# EAGLE design KIM_6530_replacement (EAGLE 6.6.0)
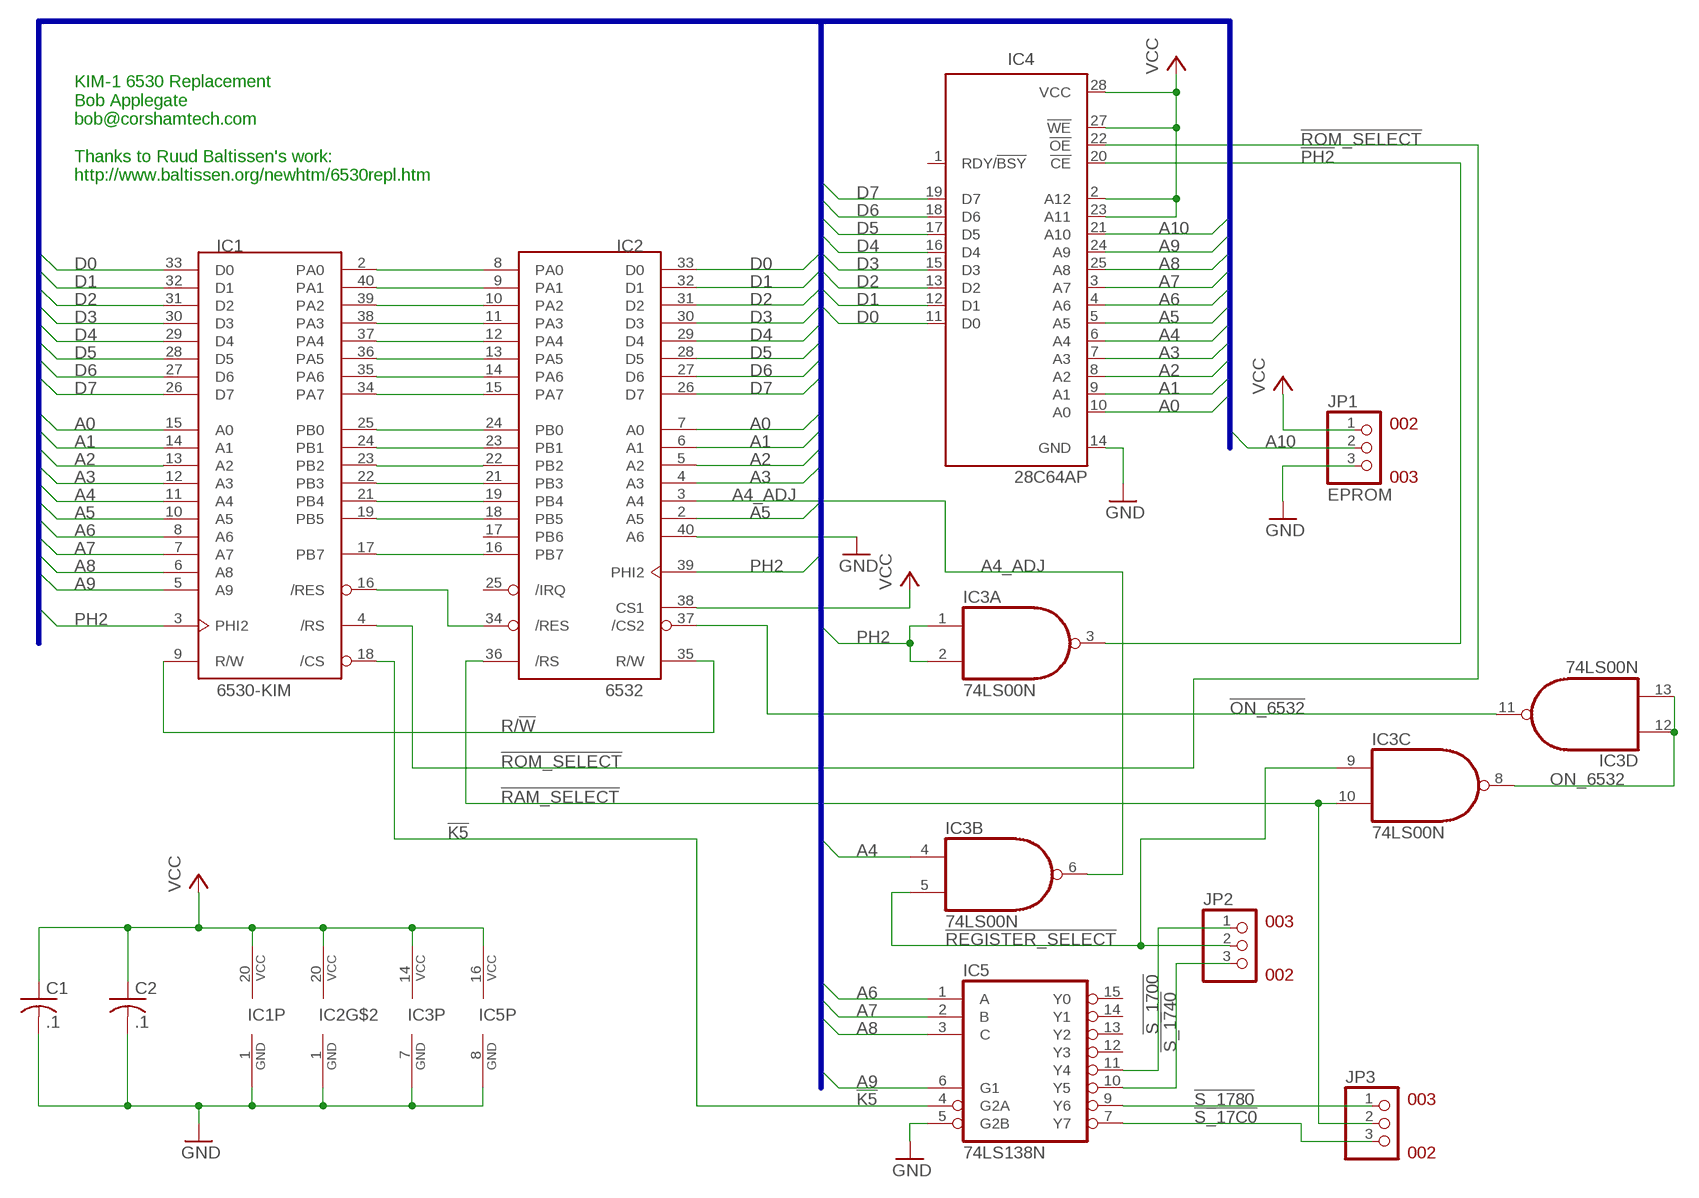
[diagram p0: schematic, sheet 1]

## Parts
C1  .1  C-US025-025X050  [C025-025X050]
C2  .1  C-US025-025X050  [C025-025X050]
IC1  6530-KIM  [DIP40]
IC2  6532  [DIP40]
IC3  74LS00N  [DIL14]
IC4  28C64AP  [DIL28-6]
IC5  74LS138N  [DIL16]
JP1  EPROM  PINHD-1X3  [1X03]
JP2  PINHD-1X3  [1X03]
JP3  PINHD-1X3  [1X03]

## Nets
!K5: IC1.18(/CS) IC5.4(G2A)
!ON_6532: IC2.37(/CS2) IC3.11(D:O)
!PH2: IC3.3(A:O) IC4.20(!CE)
!RAM_SELECT: IC2.36(/RS) IC3.10(C:I1) JP3.2
!REGISTER_SELECT: IC3.5(B:I1) IC3.9(C:I0) JP2.2
!ROM_SELECT: IC1.4(/RS) IC4.22(!OE)
!S_17C0: IC5.7(Y7) JP3.3
!S_1700: IC5.11(Y4) JP2.1
!S_1740: IC5.10(Y5) JP2.3
!S_1780: IC5.9(Y6) JP3.1
A0: IC1.15(A0) IC2.7(A0) IC4.10(A0)
A1: IC1.14(A1) IC2.6(A1) IC4.9(A1)
A2: IC1.13(A2) IC2.5(A2) IC4.8(A2)
A3: IC1.12(A3) IC2.4(A3) IC4.7(A3)
A4: IC1.11(A4) IC3.4(B:I0) IC4.6(A4)
A4_ADJ: IC2.3(A4) IC3.6(B:O)
A5: IC1.10(A5) IC2.2(A5) IC4.5(A5)
A6: IC1.8(A6) IC4.4(A6) IC5.1(A)
A7: IC1.7(A7) IC4.3(A7) IC5.2(B)
A8: IC1.6(A8) IC4.25(A8) IC5.3(C)
A9: IC1.5(A9) IC4.24(A9) IC5.6(G1)
A10: IC4.21(A10) JP1.2
D0: IC1.33(D0) IC2.33(D0) IC4.11(D0)
D1: IC1.32(D1) IC2.32(D1) IC4.12(D1)
D2: IC1.31(D2) IC2.31(D2) IC4.13(D2)
D3: IC1.30(D3) IC2.30(D3) IC4.15(D3)
D4: IC1.29(D4) IC2.29(D4) IC4.16(D4)
D5: IC1.28(D5) IC2.28(D5) IC4.17(D5)
D6: IC1.27(D6) IC2.27(D6) IC4.18(D6)
D7: IC1.26(D7) IC2.26(D7) IC4.19(D7)
GND: C1.2 C2.2 IC1.1(GND) IC2.1(GND) IC2.40(A6) IC3.7(P:GND) IC4.14(GND) IC5.5(G2B) IC5.8(GND) JP1.3
N$1: IC1.2(PA0) IC2.8(PA0)
N$2: IC1.40(PA1) IC2.9(PA1)
N$3: IC1.39(PA2) IC2.10(PA2)
N$4: IC1.38(PA3) IC2.11(PA3)
N$5: IC1.37(PA4) IC2.12(PA4)
N$6: IC1.36(PA5) IC2.13(PA5)
N$7: IC1.35(PA6) IC2.14(PA6)
N$8: IC1.34(PA7) IC2.15(PA7)
N$9: IC1.25(PB0) IC2.24(PB0)
N$10: IC1.24(PB1) IC2.23(PB1)
N$11: IC1.23(PB2) IC2.22(PB2)
N$12: IC1.22(PB3) IC2.21(PB3)
N$13: IC1.21(PB4) IC2.19(PB4)
N$14: IC1.19(PB5) IC2.18(PB5)
N$15: IC1.17(PB7) IC2.16(PB7)
N$16: IC1.16(/RES) IC2.34(/RES)
ON_6532: IC3.8(C:O) IC3.12(D:I0) IC3.13(D:I1)
PH2: IC1.3(PHI2) IC2.39(PHI2) IC3.1(A:I0) IC3.2(A:I1)
R/!W: IC1.9(R/W) IC2.35(R/W)
VCC: C1.1 C2.1 IC1.20(VCC) IC2.20(VCC) IC2.38(CS1) IC3.14(P:VCC) IC4.2(A12) IC4.23(A11) IC4.27(!WE) IC4.28(VCC) IC5.16(VCC) JP1.1
Unconnected: IC2.17(PB6) IC2.25(/IRQ) IC4.1(RDY/!BSY) IC5.12(Y3) IC5.13(Y2) IC5.14(Y1) IC5.15(Y0)

## Buses
A[0..15],D[0..7],PH2

## Notes on the sheet
- KIM-1 6530 Replacement
  Bob Applegate
  bob@corshamtech.com
  
  Thanks to Ruud Baltissen's work:
  http://www.baltissen.org/newhtm/6530repl.htm
- 002
- 003
- 003
- 002
- 003
- 002

## Library data of the parts
C1 C2 = rcl:C-US: CAPACITOR, American symbol
IC1 = 0RB_65xx:6530-KIM: I/O device with onboard ROM and RAM. Several configurations possible. This is the KIM version.
IC2 = 0RB_65xx:6532: I/O device with onboard 128 bytes of RAM.
IC3 = 74xx-us:74*00: Quad 2-input NAND gate
IC4 = microchip:28*64A: CMOS EEPROM 64 K (8 K x 8), low voltage; MPN: AT28C64B-15PU; OC_FARNELL: 1631144; OC_NEWARK: 96K6557
IC5 = 74xx-us:74*138: 3-line to 8-line DECODER/DEMULTIPLEXER
JP1-JP3 = pinhead:PINHD-1X3: PIN HEADER

## Board
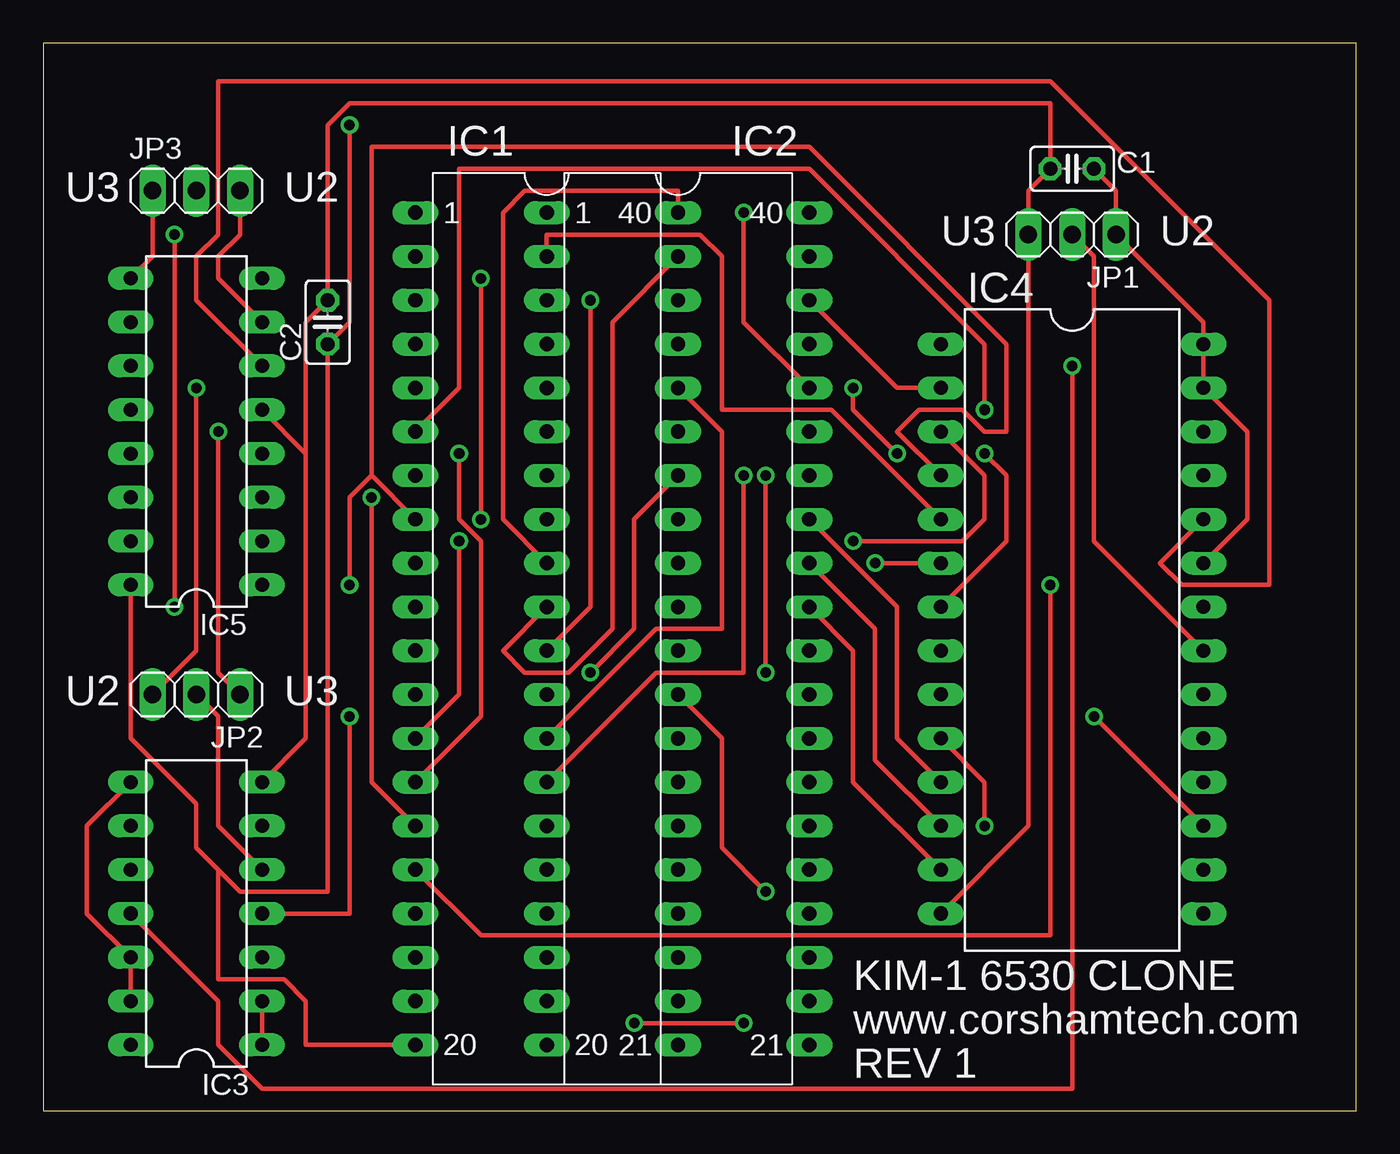
[diagram p1: board, top side]
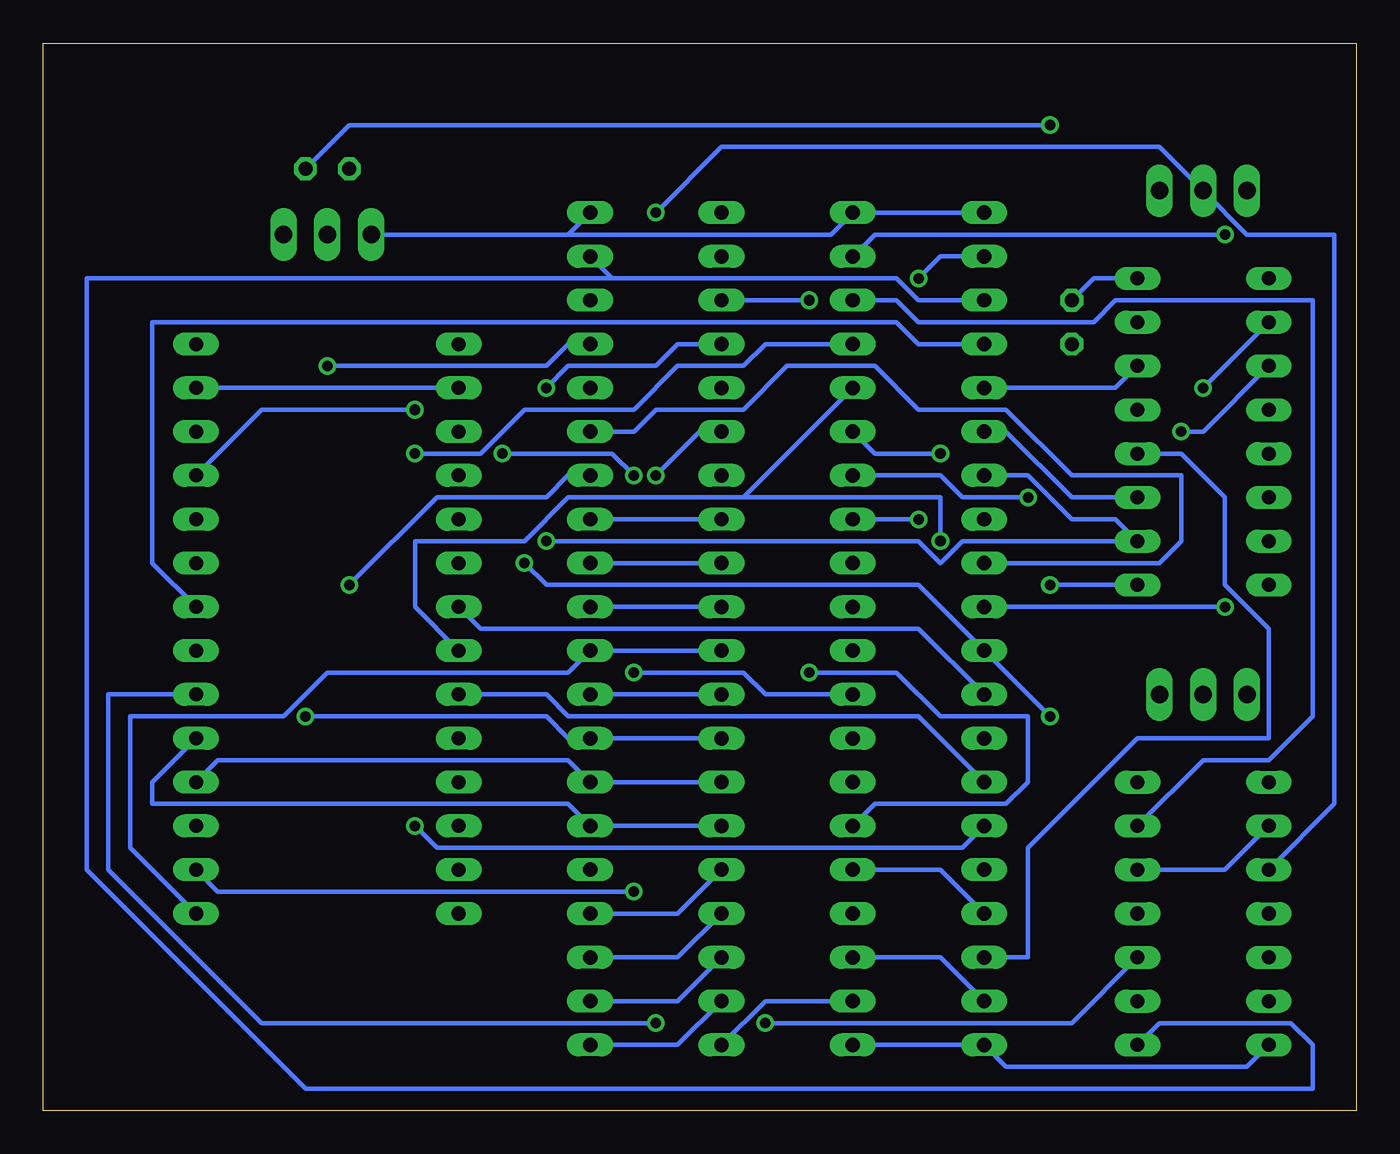
[diagram p2: board, bottom side, seen from below]

Size 76.18 x 61.9 mm. Coordinates in mm from the lower left corner, seen from the top.
Outline: 0,0 76.18,0 76.18,61.9 0,61.9 0,0
Copper layers (1*16): Top 0.035mm / dielectric 1.5mm / Bottom 0.035mm
Design rules "default": minimum track width 10mil, minimum drill 24mil, track to track 8mil, track to pad 8mil, pad to pad 8mil, via to via 8mil, smd to smd 8mil, copper to edge 40mil, drill to drill 8mil, minimum pad ring 10mil, minimum via ring 8mil, stop-mask expansion 4mil, vias tented up to drill 0mil, thermal gap 10mil

### Footprints (pad centres in the part's own frame; a part is rotated, then mirrored left to right if it is on the bottom)
C025-025X050 = drill 0.813 octagon: 1 -1.27,0; 2 1.27,0
DIP40 = drill 0.838 long: 1 -24.13,-7.62; 2 -21.59,-7.62; 3 -19.05,-7.62; 4 -16.51,-7.62; 5 -13.97,-7.62; 6 -11.43,-7.62; 7 -8.89,-7.62; 8 -6.35,-7.62; 9 -3.81,-7.62; 10 -1.27,-7.62; 11 1.27,-7.62; 12 3.81,-7.62; 13 6.35,-7.62; 14 8.89,-7.62; 15 11.43,-7.62; 16 13.97,-7.62; 17 16.51,-7.62; 18 19.05,-7.62; 19 21.59,-7.62; 20 24.13,-7.62; 21 24.13,7.62; 22 21.59,7.62; 23 19.05,7.62; 24 16.51,7.62; 25 13.97,7.62; 26 11.43,7.62; 27 8.89,7.62; 28 6.35,7.62; 29 3.81,7.62; 30 1.27,7.62; 31 -1.27,7.62; 32 -3.81,7.62; 33 -6.35,7.62; 34 -8.89,7.62; 35 -11.43,7.62; 36 -13.97,7.62; 37 -16.51,7.62; 38 -19.05,7.62; 39 -21.59,7.62; 40 -24.13,7.62
DIL14 = drill 0.813 long: 1 -7.62,-3.81; 2 -5.08,-3.81; 3 -2.54,-3.81; 4 0,-3.81; 5 2.54,-3.81; 6 5.08,-3.81; 7 7.62,-3.81; 8 7.62,3.81; 9 5.08,3.81; 10 2.54,3.81; 11 0,3.81; 12 -2.54,3.81; 13 -5.08,3.81; 14 -7.62,3.81
DIL28-6 = drill 0.813 long: 1 -16.51,-7.62; 2 -13.97,-7.62; 3 -11.43,-7.62; 4 -8.89,-7.62; 5 -6.35,-7.62; 6 -3.81,-7.62; 7 -1.27,-7.62; 8 1.27,-7.62; 9 3.81,-7.62; 10 6.35,-7.62; 11 8.89,-7.62; 12 11.43,-7.62; 13 13.97,-7.62; 14 16.51,-7.62; 15 16.51,7.62; 16 13.97,7.62; 17 11.43,7.62; 18 8.89,7.62; 19 6.35,7.62; 20 3.81,7.62; 21 1.27,7.62; 22 -1.27,7.62; 23 -3.81,7.62; 24 -6.35,7.62; 25 -8.89,7.62; 26 -11.43,7.62; 27 -13.97,7.62; 28 -16.51,7.62
DIL16 = drill 0.813 long: 1 -8.89,-3.81; 2 -6.35,-3.81; 3 -3.81,-3.81; 4 -1.27,-3.81; 5 1.27,-3.81; 6 3.81,-3.81; 7 6.35,-3.81; 8 8.89,-3.81; 9 8.89,3.81; 10 6.35,3.81; 11 3.81,3.81; 12 1.27,3.81; 13 -1.27,3.81; 14 -3.81,3.81; 15 -6.35,3.81; 16 -8.89,3.81
1X03 = drill 1.016 long: 1 -2.54,0; 2 0,0; 3 2.54,0

### Placement (x,y rotation side)
C1  59.69,54.61 180 top
C2  16.51,45.72 90 top
IC1  29.21,27.94 270 top
IC2  36.83,27.94 270 top
IC3  8.89,11.43 90 top
IC4  59.69,27.94 270 top
IC5  8.89,39.37 90 top
JP1  59.69,50.8 180 top
JP2  8.89,24.13 180 top
JP3  8.89,53.34 0 top

### Tracks (layer width: path | path; a pad name or v marks a point on that pad's centre or on a via)
!K5
  Bottom 0.254: IC5.4 10.16,38.1 7.62,35.56 7.62,30.48 5.08,27.94 5.08,21.59 12.7,21.59 19.05,15.24 19.05,8.89 IC1.18
!ON_6532  (via drill 0.61)
  Top 0.254: IC3.11 10.16,6.35 10.16,3.81 12.7,1.27 59.69,1.27 v59.69,43.18
  Bottom 0.254: v59.69,43.18 46.99,43.18 45.72,44.45 IC2.37
!PH2  (via drill 0.61)
  Top 0.254: v40.64,5.08 v34.29,5.08
  Bottom 0.254: IC3.3 16.51,5.08 v34.29,5.08 | v40.64,5.08 63.5,5.08 72.39,13.97 72.39,24.13 IC4.20
!RAM_SELECT  (via drill 0.61)
  Top 0.254: IC2.36 40.64,45.72 v40.64,52.07
  Bottom 0.254: IC3.10 1.27,17.78 1.27,50.8 6.35,50.8 JP3.2 11.43,55.88 36.83,55.88 v40.64,52.07
!REGISTER_SELECT
  Top 0.254: JP2.2 10.16,22.86 10.16,16.51 IC3.5
  Bottom 0.254: IC3.9 7.62,13.97 IC3.5
!ROM_SELECT
  Bottom 0.254: IC4.22 69.85,31.75 69.85,45.72 26.67,45.72 25.4,44.45 IC1.4
!S_17C0
  Top 0.254: IC5.7 10.16,48.26 10.16,49.53 11.43,50.8 JP3.3
!S_1700  (via drill 0.61)
  Top 0.254: v10.16,39.37 10.16,25.4 JP2.1
  Bottom 0.254: IC5.11 8.89,39.37 v10.16,39.37
!S_1740  (via drill 0.61)
  Top 0.254: v8.89,41.91 8.89,26.67 JP2.3
  Bottom 0.254: v8.89,41.91 IC5.10
!S_1780
  Top 0.254: IC5.9 6.35,49.53 JP3.1
A0  (via drill 0.61)
  Top 0.254: IC4.10 54.61,19.05 v54.61,16.51 | v19.05,35.56 19.05,19.05 IC1.15
  Bottom 0.254: v54.61,16.51 53.34,15.24 22.86,15.24 IC1.15 | IC2.7 24.13,36.83 22.86,35.56 v19.05,35.56
A1  (via drill 0.61)
  Top 0.254: v24.13,38.1 24.13,34.29 25.4,33.02 25.4,22.86 IC1.14
  Bottom 0.254: IC4.9 46.99,24.13 45.72,22.86 25.4,22.86 IC1.14 | IC2.6 27.94,38.1 v24.13,38.1
A2  (via drill 0.61)
  Top 0.254: IC1.13 24.13,24.13 v24.13,33.02
  Bottom 0.254: IC4.8 54.61,29.21 54.61,33.02 48.26,33.02 45.72,35.56 35.56,35.56 | IC2.5 35.56,35.56 | v24.13,33.02 24.13,35.56 35.56,35.56
A3  (via drill 0.61)
  Top 0.254: v54.61,38.1 55.88,36.83 55.88,33.02 IC4.7
  Bottom 0.254: IC4.7 50.8,27.94 25.4,27.94 IC1.12 | IC2.4 34.29,44.45 35.56,43.18 39.37,43.18 41.91,40.64 48.26,40.64 50.8,38.1 v54.61,38.1
A4  (via drill 0.61)
  Top 0.254: IC3.4 17.78,11.43 v17.78,22.86 | v48.26,31.75 IC4.6
  Bottom 0.254: v17.78,22.86 IC1.11 25.4,30.48 46.99,30.48 v48.26,31.75
A4_ADJ
  Bottom 0.254: IC3.6 8.89,20.32 5.08,20.32 2.54,22.86 2.54,46.99 13.97,46.99 15.24,45.72 25.4,45.72 26.67,46.99 IC2.3
A5  (via drill 0.61)
  Top 0.254: IC4.5 45.72,40.64 39.37,40.64 39.37,49.53 38.1,50.8 29.21,50.8 IC2.2 | v7.62,50.8 v7.62,29.21
  Bottom 0.254: v7.62,29.21 IC1.10 | v7.62,50.8 27.94,50.8 IC2.2
A6  (via drill 0.61)
  Top 0.254: v17.78,30.48 17.78,35.56 19.05,36.83 | IC1.8 19.05,36.83 | IC4.4 49.53,39.37 50.8,40.64 53.34,40.64 54.61,39.37 55.88,39.37 55.88,44.45 44.45,55.88 19.05,55.88 19.05,36.83
  Bottom 0.254: v17.78,30.48 IC5.1
A7  (via drill 0.61)
  Top 0.254: IC4.3 54.61,36.83 54.61,34.29 53.34,33.02 v46.99,33.02
  Bottom 0.254: IC1.7 19.05,36.83 16.51,34.29 13.97,34.29 IC5.2 22.86,33.02 24.13,31.75 25.4,33.02 v46.99,33.02
A8  (via drill 0.61)
  Top 0.254: v54.61,40.64 54.61,44.45 44.45,54.61 24.13,54.61 24.13,41.91 IC1.6
  Bottom 0.254: IC5.3 16.51,35.56 20.32,39.37 IC1.6 | IC4.25 63.5,40.64 v54.61,40.64
A9
  Top 0.254: IC4.24 64.77,31.75 66.04,30.48 71.12,30.48 71.12,46.99 58.42,59.69 10.16,59.69 10.16,50.8 8.89,49.53 8.89,46.99 IC5.6
  Bottom 0.254: IC5.6 13.97,41.91 IC1.5
A10
  Top 0.254: IC4.21 60.96,33.02 60.96,49.53 JP1.2
D0
  Top 0.254: IC4.11 49.53,21.59 49.53,29.21 IC2.33
  Bottom 0.254: IC2.33 IC1.33
D1
  Top 0.254: IC4.12 48.26,20.32 48.26,27.94 IC2.32
  Bottom 0.254: IC2.32 IC1.32
D2
  Top 0.254: IC4.13 46.99,19.05 46.99,26.67 IC2.31
  Bottom 0.254: IC2.31 IC1.31
D3
  Bottom 0.254: IC4.15 71.12,15.24 71.12,22.86 62.23,22.86 59.69,25.4 45.72,25.4 IC2.30 IC1.30
D4  (via drill 0.61)
  Top 0.254: v41.91,12.7 39.37,15.24 39.37,21.59 IC1.29
  Bottom 0.254: IC4.16 66.04,12.7 v41.91,12.7 | IC1.29 IC2.29
D5  (via drill 0.61)
  Top 0.254: v60.96,22.86 IC4.17
  Bottom 0.254: v60.96,22.86 46.99,22.86 45.72,21.59 IC2.28 IC1.28
D6
  Bottom 0.254: IC4.18 66.04,20.32 45.72,20.32 IC2.27 IC1.27
D7
  Bottom 0.254: IC4.19 69.85,19.05 69.85,17.78 45.72,17.78 IC2.26 IC1.26
GND
  Top 0.254: IC3.7 15.24,21.59 15.24,38.1 | IC5.5 15.24,38.1 | 15.24,38.1 15.24,45.72 C2.2 16.51,57.15 17.78,58.42 58.42,58.42 C1.2 57.15,53.34 JP1.3 57.15,16.51 IC4.14
  Bottom 0.254: C2.2 15.24,48.26 IC5.8 | IC1.1 IC2.1 30.48,50.8 45.72,50.8 | 45.72,50.8 IC2.40 | JP1.3 45.72,50.8
N$1  (via drill 0.61)
  Top 0.254: v25.4,48.26 v25.4,34.29
  Bottom 0.254: v25.4,34.29 IC2.8 | v25.4,48.26 24.13,49.53 IC1.2
N$2
  Top 0.254: IC2.9 26.67,34.29 26.67,52.07 27.94,53.34 36.83,53.34 IC1.40
N$3
  Top 0.254: IC2.10 26.67,26.67 27.94,25.4 30.48,25.4 33.02,27.94 33.02,45.72 IC1.39
N$4  (via drill 0.61)
  Top 0.254: IC2.11 31.75,29.21 v31.75,46.99
  Bottom 0.254: IC1.38 v31.75,46.99
N$5  (via drill 0.61)
  Top 0.254: v41.91,36.83 v41.91,25.4 | v49.53,38.1 46.99,40.64 v46.99,41.91
  Bottom 0.254: IC2.12 34.29,24.13 35.56,25.4 v41.91,25.4 | v41.91,36.83 43.18,38.1 v49.53,38.1 | v46.99,41.91 45.72,43.18 40.64,43.18 39.37,44.45 IC1.37
N$6
  Top 0.254: IC2.13 35.56,27.94 39.37,27.94 39.37,39.37 IC1.36
N$7  (via drill 0.61)
  Top 0.254: IC2.14 35.56,25.4 40.64,25.4 v40.64,36.83
  Bottom 0.254: v40.64,36.83 38.1,39.37 IC1.35
N$8  (via drill 0.61)
  Top 0.254: v31.75,25.4 34.29,27.94 34.29,34.29 IC1.34
  Bottom 0.254: IC2.15 27.94,17.78 20.32,17.78 19.05,19.05 19.05,22.86 24.13,22.86 26.67,25.4 v31.75,25.4
N$9
  Bottom 0.254: IC1.25 39.37,11.43 IC2.24
N$10
  Bottom 0.254: IC1.24 39.37,8.89 IC2.23
N$11
  Bottom 0.254: IC1.23 39.37,6.35 IC2.22
N$12
  Bottom 0.254: IC1.22 39.37,3.81 IC2.21
N$13
  Bottom 0.254: IC2.19 34.29,6.35 IC1.21
N$14
  Bottom 0.254: IC1.19 24.13,8.89 IC2.18
N$15
  Bottom 0.254: IC1.17 24.13,13.97 IC2.16
N$16  (via drill 0.61)
  Top 0.254: IC1.16 25.4,10.16 58.42,10.16 v58.42,30.48
  Bottom 0.254: v58.42,30.48 53.34,35.56 46.99,35.56 45.72,36.83 IC2.34
ON_6532
  Top 0.254: IC3.13 IC3.12 2.54,11.43 2.54,16.51 IC3.8
PH2
  Top 0.254: IC3.1 IC3.2
  Bottom 0.254: IC1.3 25.4,46.99 26.67,48.26 43.18,48.26 | IC2.39 43.18,48.26 | IC3.1 11.43,5.08 3.81,5.08 2.54,3.81 2.54,1.27 60.96,1.27 73.66,13.97 73.66,48.26 43.18,48.26
R/!W
  Bottom 0.254: IC1.9 11.43,31.75 10.16,33.02 10.16,36.83 16.51,36.83 20.32,40.64 25.4,40.64 27.94,43.18 33.02,43.18 35.56,40.64 40.64,40.64 41.91,39.37 IC2.35
VCC  (via drill 0.61)
  Top 0.254: C1.1 62.23,53.34 JP1.1 67.31,45.72 IC4.28 IC4.27 69.85,39.37 69.85,34.29 IC4.23 | IC2.38 49.53,41.91 IC4.2 | IC5.16 5.08,21.59 8.89,17.78 8.89,15.24 10.16,13.97 | 10.16,13.97 11.43,12.7 16.51,12.7 C2.1 17.78,45.72 v17.78,57.15 | IC1.20 15.24,3.81 15.24,6.35 13.97,7.62 10.16,7.62 10.16,13.97
  Bottom 0.254: IC4.27 IC4.2 | IC3.14 6.35,2.54 20.32,2.54 IC1.20 IC2.20 | C1.1 58.42,57.15 v17.78,57.15

### Text on the board
tPlace: U3 | U2 | U3 | U2 | U2 | U3 | KIM-1 6530 CLONE | www.corshamtech.com | REV 1